# EAGLE design switching-led-driver-v2.0 (EAGLE 7.5.0)
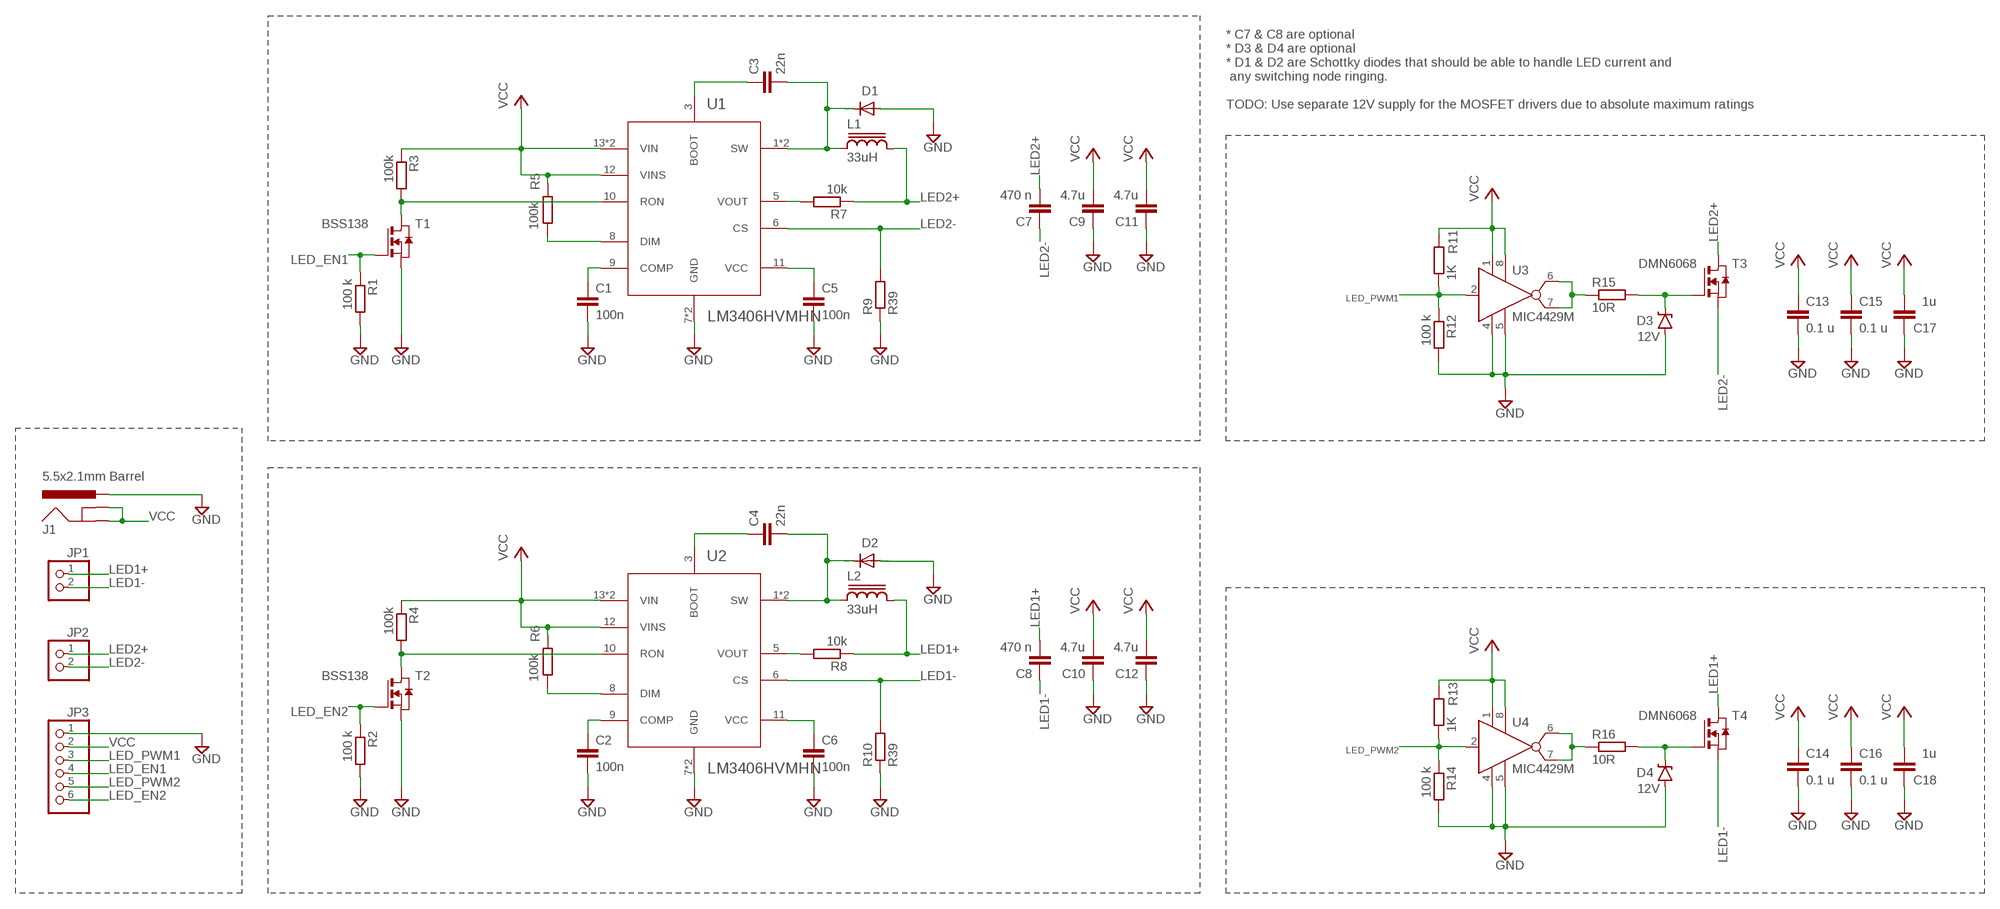
[diagram p0: schematic, sheet 1]

## Parts
C1  100n  C-EUC0805  [C0805]
C2  100n  C-EUC0805  [C0805]
C3  22n  C-EUC1206  [C1206]
C4  22n  C-EUC1206  [C1206]
C5  100n  C-EUC0805  [C0805]
C6  100n  C-EUC0805  [C0805]
C7  470 n  C-EUC1206  [C1206]
C8  470 n  C-EUC1206  [C1206]
C9  4.7u  C-EUC1210  [C1210]
C10  4.7u  C-EUC1210  [C1210]
C11  4.7u  C-EUC1210  [C1210]
C12  4.7u  C-EUC1210  [C1210]
C13  0.1 u  C-EUC0805  [C0805]
C14  0.1 u  C-EUC0805  [C0805]
C15  0.1 u  C-EUC0805  [C0805]
C16  0.1 u  C-EUC0805  [C0805]
C17  1u  C-EUC1210  [C1210]
C18  1u  C-EUC1210  [C1210]
D1  12V  DIODE-DO-214AC  [DO-214AC]
D2  12V  DIODE-DO-214AC  [DO-214AC]
D3  12V  DIODE-ZENER16V  [SOD-123]
D4  12V  DIODE-ZENER16V  [SOD-123]
J1  5.5x2.1mm Barrel  POWER_JACKSMD  [POWER_JACK_SMD]
JP1  PINHD-1X2  [1X02]
JP2  PINHD-1X2  [1X02]
JP3  PINHD-1X6  [1X06]
L1  33uH  SRR1260  [SRR1260]
L2  33uH  SRR1260  [SRR1260]
R1  100 k  R-EU_R0805  [R0805]
R2  100 k  R-EU_R0805  [R0805]
R3  100k  R-EU_R0805  [R0805]
R4  100k  R-EU_R0805  [R0805]
R5  100k  R-EU_R0805  [R0805]
R6  100k  R-EU_R0805  [R0805]
R7  10k  R-EU_R0805  [R0805]
R8  10k  R-EU_R0805  [R0805]
R9  R39  R-EU_R1206  [R1206]
R10  R39  R-EU_R1206  [R1206]
R11  1K  R-EU_R0805  [R0805]
R12  100 k  R-EU_R0805  [R0805]
R13  1K  R-EU_R0805  [R0805]
R14  100 k  R-EU_R0805  [R0805]
R15  10R  R-EU_R0805  [R0805]
R16  10R  R-EU_R0805  [R0805]
T1  BSS138  NMOSSOT23  [SOT-23]
T2  BSS138  NMOSSOT23  [SOT-23]
T3  DMN6068  NMOSSOT223  [SOT223]
T4  DMN6068  NMOSSOT223  [SOT223]
U1  LM3406HVMHN  [HTSSOP-14-NN]
U2  LM3406HVMHN  [HTSSOP-14-NN]
U3  MIC4429M  [SO08]
U4  MIC4429M  [SO08]

## Nets
GND: C1.2 C2.2 C5.2 C6.2 C9.1 C10.1 C11.1 C12.1 C13.2 C14.2 C15.2 C16.2 C17.1 C18.1 D1.A D2.A D3.A D4.A J1.VIN0(PWR) JP3.1 R1.2 R2.2 R9.1 R10.1 R12.2 R14.2 T1.2(S) T2.2(S) U1.7(GND) U1.15(GND) U2.7(GND) U2.15(GND) U3.4(GND1) U3.5(GND2) U4.4(GND1) U4.5(GND2)
LED1+: C8.2 JP1.1 L2.2 R8.1 T4.2(D) T4.4(D)
LED1-: C8.1 JP1.2 R10.2 T4.3(S) U2.6(CS)
LED2+: C7.2 JP2.1 L1.2 R7.1 T3.2(D) T3.4(D)
LED2-: C7.1 JP2.2 R9.2 T3.3(S) U1.6(CS)
LED_EN1: JP3.4 R1.1 T1.3(G)
LED_EN2: JP3.6 R2.1 T2.3(G)
LED_PWM1: JP3.3 R11.1 R12.1 U3.2(IN)
LED_PWM2: JP3.5 R13.1 R14.1 U4.2(IN)
N$1: R4.2 T2.1(D) U2.10(RON)
N$2: C2.1 U2.9(COMP)
N$3: C6.1 U2.11(VCC)
N$4: R16.1 U4.6(OUT1) U4.7(OUT2)
N$5: R8.2 U2.5(VOUT)
N$6: D3.C R15.2 T3.1(G)
N$7: D4.C R16.2 T4.1(G)
N$8: R3.2 T1.1(D) U1.10(RON)
N$9: C1.1 U1.9(COMP)
N$10: C5.1 U1.11(VCC)
N$11: C3.1 U1.3(BOOT)
N$12: C4.1 U2.3(BOOT)
N$13: R7.2 U1.5(VOUT)
N$14: R15.1 U3.6(OUT1) U3.7(OUT2)
PWM_IN_INT: R6.1 U2.8(DIM)
PWM_IN_INT1: R5.1 U1.8(DIM)
SW: C4.2 D2.C L2.1 U2.1(SW) U2.2(SW)
SW1: C3.2 D1.C L1.1 U1.1(SW) U1.2(SW)
VCC: C9.2 C10.2 C11.2 C12.2 C13.1 C14.1 C15.1 C16.1 C17.2 C18.2 J1.GND(GNDBREAK) J1.P$4(GND) JP3.2 R3.1 R4.1 R5.2 R6.2 R11.2 R13.2 U1.12(VINS) U1.13(VIN) U1.14(VIN) U2.12(VINS) U2.13(VIN) U2.14(VIN) U3.1(VS1) U3.8(VS2) U4.1(VS1) U4.8(VS2)

## Notes on the sheet
- * C7 & C8 are optional
  * D3 & D4 are optional
  * D1 & D2 are Schottky diodes that should be able to handle LED current and 
   any switching node ringing.
  
  TODO: Use separate 12V supply for the MOSFET drivers due to absolute maximum ratings

## Library data of the parts
C1-C12 C17 C18 = rcl:C-EU: CAPACITOR, European symbol; OC_FARNELL: 1759518
C13-C16 = rcl:C-EU: CAPACITOR, European symbol; OC_FARNELL: 1856626
D1 D2 = diode:DIODE-: DIODE; OC_FARNELL: 1702810
D3 D4 = sparkfun-misc-parts-1:DIODE-ZENER: Zener Diode Production Part - 8199 3.4V Zener Voltage; OC_FARNELL: 2061479; PROD_ID: DIO-12440; VALUE: 16V
J1 = SparkFun-Connectors:POWER_JACK: Power Jack This is the standard 5.5mm barrel jack for power. The PTH is the most common, proven, reliable, footprint. The Slot footprint only works if the mill layer is transmitted to the PCB fab house so be warned. Mating wall wart : TOL-00298 (and others); PROD_ID: CONN-08106; SF_ID: PRT-12748
JP1 JP2 = pinhead:PINHD-1X2: PIN HEADER
JP3 = pinhead:PINHD-1X6: PIN HEADER
L1 L2 = inductor-bourns:SRR1260: POWER INDUCTOR; OC_FARNELL: 2374128
R1-R4 R7-R10 R15 R16 = rcl:R-EU_: RESISTOR, European symbol; OC_FARNELL: 9336982
R5 R6 R11 R13 = rcl:R-EU_: RESISTOR, European symbol; OC_FARNELL: 2447473
R12 R14 = rcl:R-EU_: RESISTOR, European symbol; OC_FARNELL: 9337024
T1 T2 = zetex:NMOSSOT23: MOS FET; OC_FARNELL: 2053833; OC_NEWARK: unknown
T3 T4 = zetex:NMOSSOT223: MOS FET; OC_FARNELL: 2061415; OC_NEWARK: unknown
U1 U2 = misc-parts:LM3406HVMH: Constant Current Buck Regulator
U3 U4 = misc-parts:MIC4429: 6A-Peak Low-Side MOSFET Driver (INVERTED) Bipolar/CMOS/DMOS Process http://www.micrel.com/_PDF/mic4420.pdf

## Board
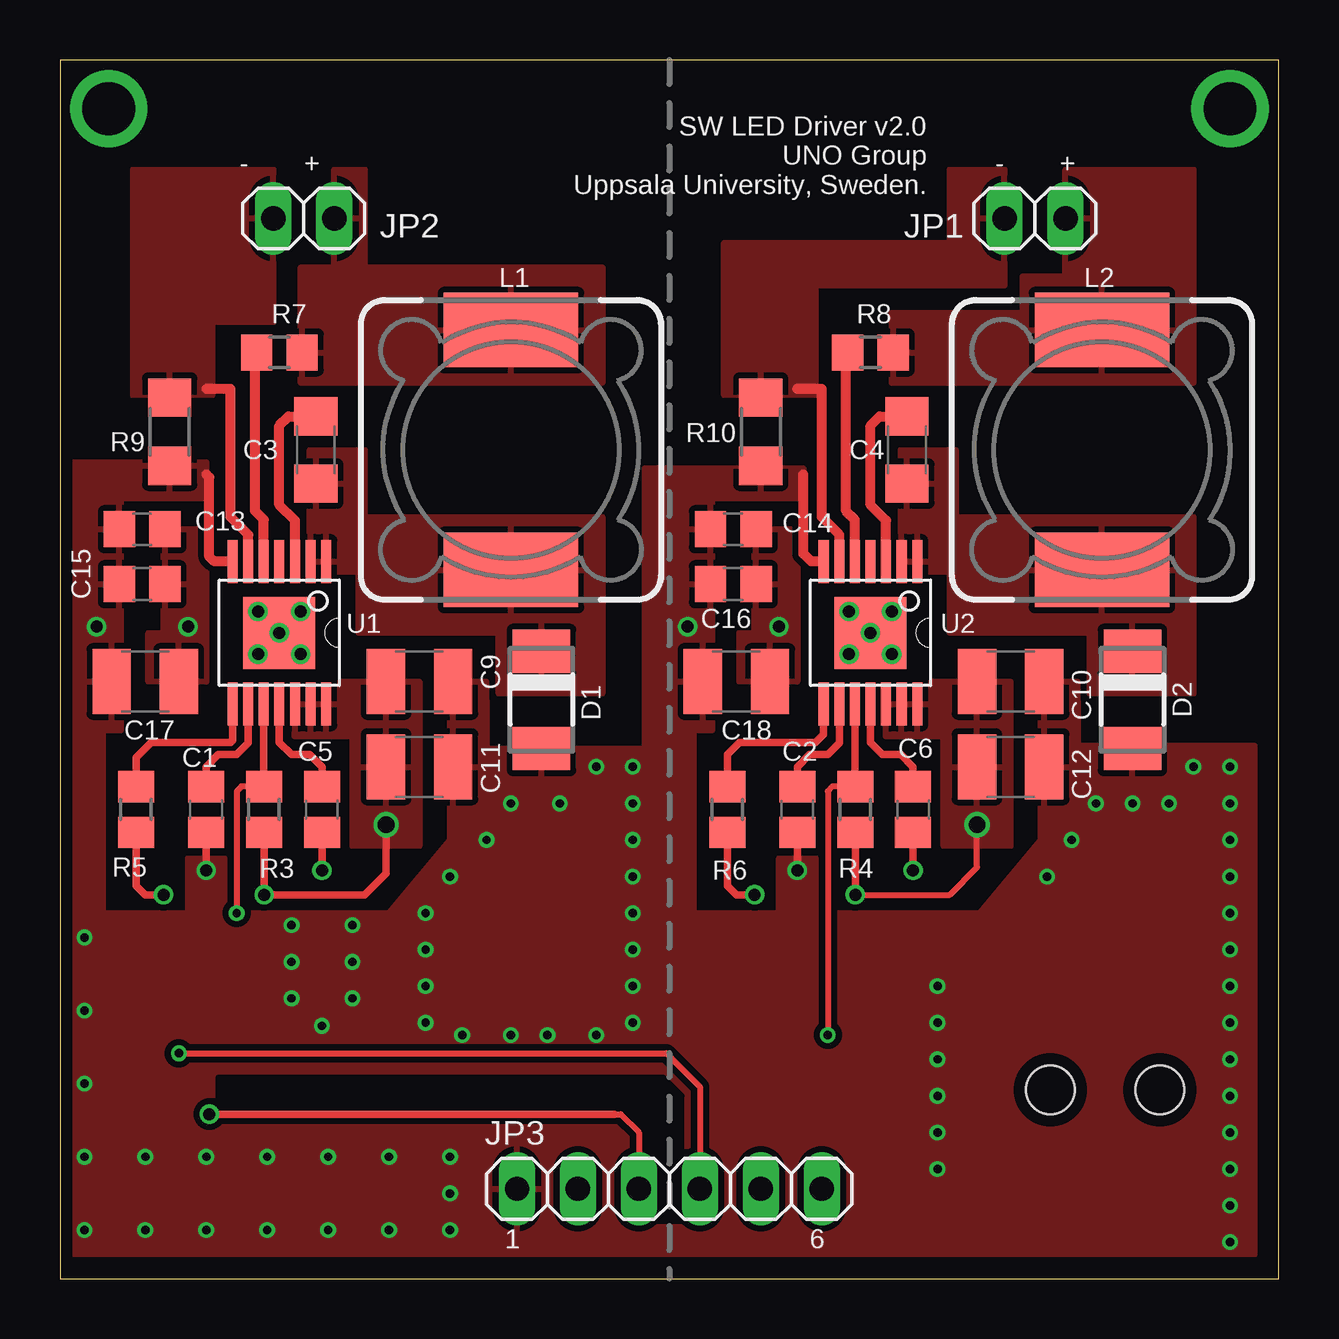
[diagram p1: board, top side]
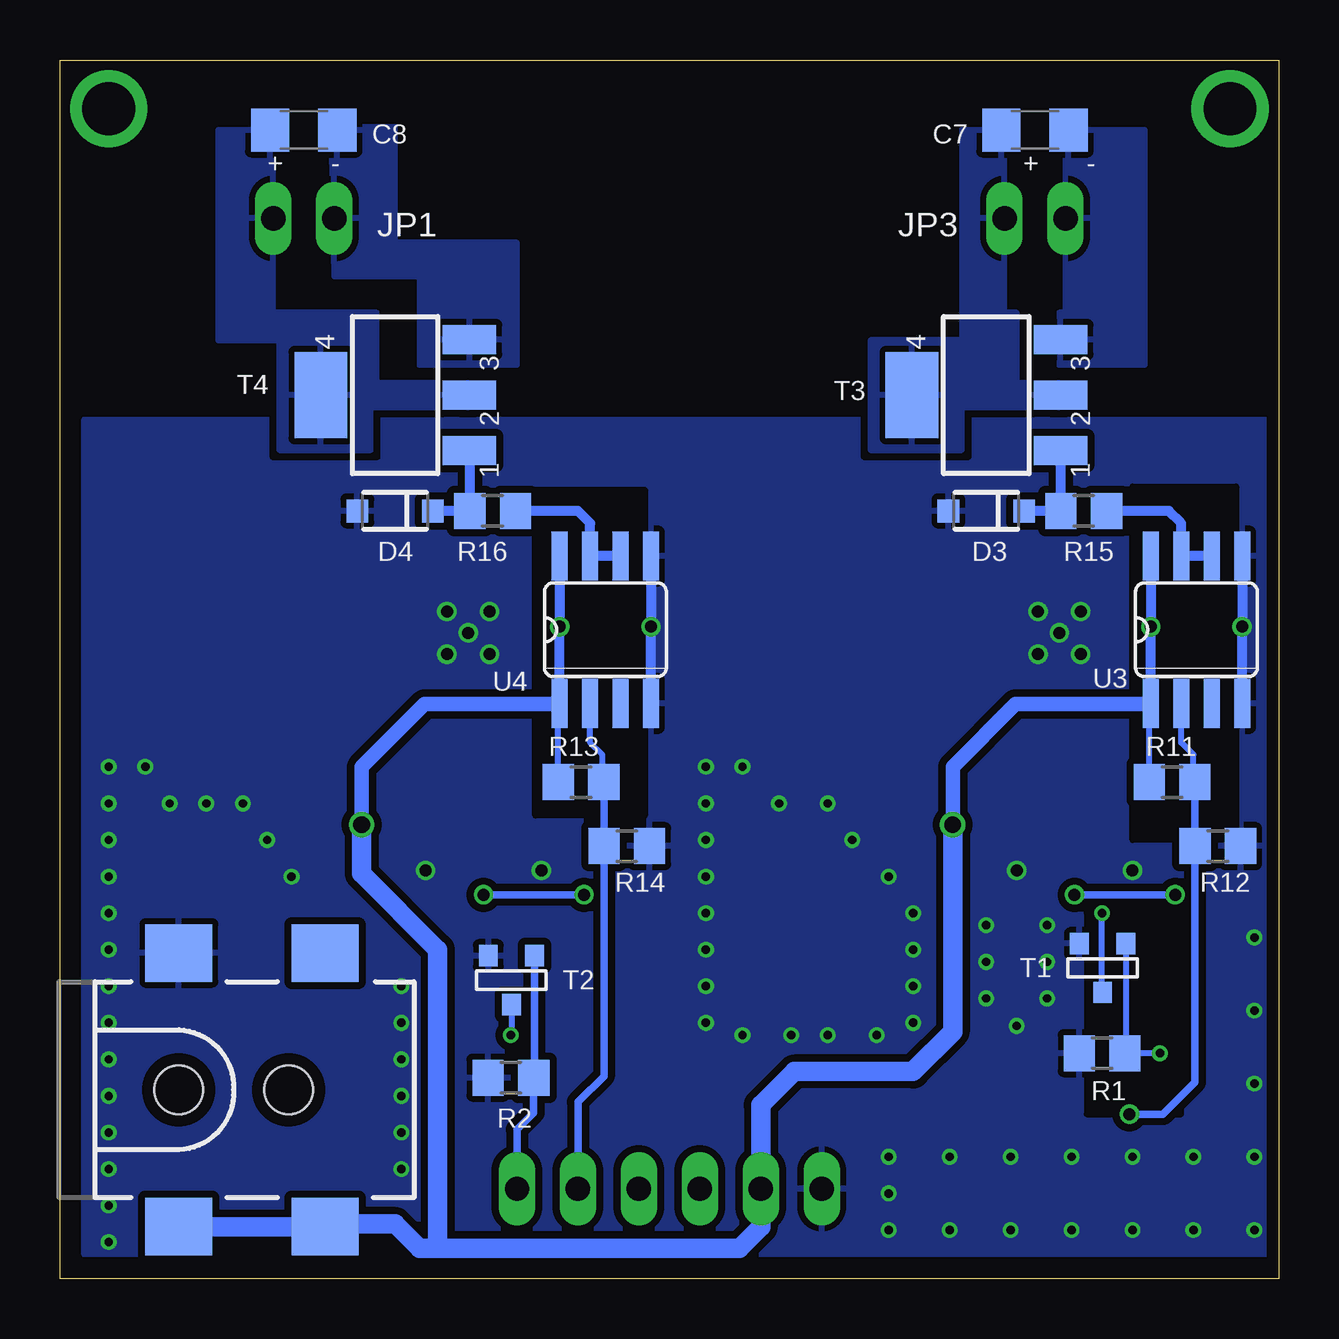
[diagram p2: board, bottom side, seen from below]

Size 50.8 x 50.8 mm. Coordinates in mm from the lower left corner, seen from the top.
Outline: 0,0 50.8,0 50.8,50.8 0,50.8 0,0
Copper layers (1*16): Top 0.035mm / dielectric 1.6mm / Bottom 0.035mm
Design rules "Elecrow-2-layer_PCB_eagle_rule": minimum track width 6mil, minimum drill 12mil, track to track 6mil, track to pad 8mil, pad to pad 12mil, via to via 12mil, smd to smd 0mil, copper to edge 20mil, drill to drill 10mil, minimum pad ring 6mil, minimum via ring 6mil, stop-mask expansion 0mil, vias tented up to drill 100mil, thermal gap 10mil

### Footprints (pad centres in the part's own frame; a part is rotated, then mirrored left to right if it is on the bottom)
C0805 = smd 1.3 x 1.5: 1 -0.95,0; 2 0.95,0
C1206 = smd 1.6 x 1.8: 1 -1.4,0; 2 1.4,0
C1210 = smd 1.6 x 2.7: 1 -1.4,0; 2 1.4,0
DO-214AC = smd 1.8 x 2.4: A 2.025,0; C -2.025,0
SOD-123 = smd 0.9 x 0.95: A 1.575,0; C -1.575,0
POWER_JACK_SMD = smd 2.8 x 2.4: GND 0,-5.7; P$4 6.1,-5.7; VIN0 0,5.7; VIN1 6.1,5.7 | hole 2.032: 0,0; 4.572,0
1X02 = drill 1.016 long: 1 -1.27,0; 2 1.27,0
1X06 = drill 1.016 long: 1 -6.35,0; 2 -3.81,0; 3 -1.27,0; 4 1.27,0; 5 3.81,0; 6 6.35,0
SRR1260 = smd 5.6 x 3.1: 1 0,5; 2 0,-5
R0805 = smd 1.3 x 1.5: 1 -0.95,0; 2 0.95,0
R1206 = smd 1.6 x 1.803: 1 -1.422,0; 2 1.422,0
SOT-23 = smd 0.787 x 0.889: 1 0.025,-1.016; 2 -0.94,1.016; 3 0.991,1.016
SOT223 = smd 1.219 x 2.235: 1 -2.311,-3.099; 2 0,-3.099; 3 2.311,-3.099 | smd 3.6 x 2.2: 4 0,3.099
HTSSOP-14-NN = smd 0.42 x 1.78: 1 -1.95,-2.97; 2 -1.3,-2.97; 3 -0.65,-2.97; 4 0,-2.97; 5 0.65,-2.97; 6 1.3,-2.97; 7 1.95,-2.97; 8 1.95,2.97; 9 1.3,2.97; 10 0.65,2.97; 11 0,2.97; 12 -0.65,2.97; 13 -1.3,2.97; 14 -1.95,2.97 | smd 3 x 3: 15 0,0
SO08 = smd 0.66 x 2.032: 1 -1.905,-3.073; 2 -0.635,-3.073; 3 0.635,-3.073; 4 1.905,-3.073; 5 1.905,3.073; 6 0.635,3.073; 7 -0.635,3.073; 8 -1.905,3.073

### Placement (x,y rotation side)
C1  6.1,19.56 270 top
C2  30.73,19.56 270 top
C3  10.67,34.54 270 top
C4  35.31,34.54 270 top
C5  10.92,19.56 270 top
C6  35.56,19.56 270 top
C7  10.16,47.88 180 bottom
C8  40.64,47.88 180 bottom
C9  14.99,24.89 180 top
C10  39.62,24.89 180 top
C11  14.99,21.34 180 top
C12  39.62,21.34 180 top
C13  3.43,31.24 180 top
C14  28.07,31.24 180 top
C15  3.43,28.96 180 top
C16  28.07,28.96 180 top
C17  3.56,24.89 0 top
C18  28.19,24.89 0 top
D1  20.07,24.13 270 top
D2  44.7,24.13 270 top
D3  12.19,32 180 bottom
D4  36.83,32 180 bottom
J1  45.85,7.87 0 bottom
JP1  40.64,44.2 180 top
JP2  10.16,44.2 180 top
JP3  25.4,3.75 0 top
L1  18.8,34.54 180 top
L2  43.43,34.54 180 top
R1  7.37,9.4 180 bottom
R2  32,8.38 180 bottom
R3  8.51,19.56 90 top
R4  33.15,19.56 90 top
R5  3.17,19.56 270 top
R6  27.81,19.56 270 top
R7  9.14,38.61 180 top
R8  33.78,38.61 180 top
R9  4.57,35.31 90 top
R10  29.21,35.31 90 top
R11  4.45,20.7 180 bottom
R12  2.54,18.03 0 bottom
R13  29.08,20.7 180 bottom
R14  27.18,18.03 0 bottom
R15  8.13,32 180 bottom
R16  32.77,32 180 bottom
T1  7.37,12.95 0 bottom
T2  32,12.45 0 bottom
T3  12.19,36.83 90 bottom
T4  36.83,36.83 90 bottom
U1  9.14,26.92 180 top
U2  33.78,26.92 180 top
U3  3.43,27.05 0 bottom
U4  28.07,27.05 0 bottom

### Tracks (layer width: path | path; a pad name or v marks a point on that pad's centre or on a via)
GND  (via drill 0.35, 0.5)
  Top 0.305: C2.2 v30.73,17.02 | C6.2 v35.56,17.02 | C1.2 v6.1,17.02 | C5.2 v10.92,17.02
  Top 0.406: U1.7 6.43,29.89 6.22,30.1 6.22,33.4 6.1,33.53 | U2.7 31.32,29.89 30.99,30.23 30.99,33.53
  Bottom 0.406: U4.5 v26.16,27.18 U4.4 | U3.5 v1.52,27.18 U3.4
  other vias: 33.78,26.92 32.89,27.81 32.89,26.04 34.67,27.81 34.67,26.04 9.14,26.92 8.26,27.81 8.26,26.04 10.03,27.81 10.03,26.04 47.24,21.34 48.77,21.34 46.23,19.81 44.7,19.81 43.18,19.81 42.16,18.29 41.15,16.76 48.77,19.81 48.77,18.29 48.77,16.76 48.77,15.24 48.77,13.72 48.77,12.19 48.77,10.67 48.77,9.14 36.58,12.19 36.58,10.67 36.58,9.14 48.77,7.62 48.77,6.1 48.77,4.57 48.77,3.05 48.77,1.52 36.58,7.62 36.58,6.1 36.58,4.57 23.88,19.81 23.88,21.34 22.35,21.34 20.83,19.81 18.8,19.81 23.88,18.29 23.88,16.76 23.88,15.24 23.88,13.72 23.88,12.19 23.88,10.67 17.78,18.29 16.26,16.76 15.24,15.24 15.24,13.72 15.24,12.19 15.24,10.67 16.76,10.16 20.32,10.16 22.35,10.16 18.8,10.16 16.26,5.08 16.26,2.03 16.26,3.56 13.72,5.08 13.72,2.03 11.18,2.03 8.64,2.03 6.1,2.03 3.56,2.03 1.02,2.03 11.18,5.08 8.64,5.08 6.1,5.08 3.56,5.08 1.02,5.08 1.02,8.13 1.02,11.18 1.02,14.22 12.19,14.73 9.65,14.73 9.65,13.21 9.65,11.68 12.19,13.21 12.19,11.68 10.92,10.54
  pour Top (isolate 0.254, rank 2): 40.89,24.89 42.42,24.89 42.42,22.23 49.78,22.23 49.78,1.02 0.51,1.02 0.51,34.04 6.1,34.04 6.1,32.51 2.54,32.51 2.54,22.86 1.78,22.86 1.78,15.24 5.33,15.24 5.33,17.53 6.86,17.53 6.86,15.24 13.72,15.24 16.26,18.29 16.26,24.89 17.78,24.89 17.78,22.1 24.38,22.1 24.38,33.78 30.99,33.78 30.99,32.51 27.18,32.51 27.18,22.86 26.42,22.86 26.42,15.24 29.97,15.24 29.97,17.53 31.5,17.53 31.5,15.24 38.35,15.24 40.89,18.29
  pour Bottom (isolate 0.305, rank 2): 0.51,1.02 49.78,1.02 49.78,35.81 0.51,35.81
LED1+
  pour Top (isolate 0.254): 41.91,46.23 47.24,46.23 47.24,37.34 34.67,37.34 34.67,40.26 40.13,40.26 40.13,41.78 41.91,41.78
  pour Bottom (isolate 0.254): 41.91,47.88 44.2,47.88 44.2,39.12 41.66,39.12 41.66,34.54 37.85,34.54 37.85,36.32 33.78,36.32 33.78,37.34 37.59,37.34 37.59,40.26 41.91,40.26
LED1-
  Top 0.406: U2.6 32.48,31.02 31.75,31.75 31.75,37.08 30.73,37.08
  pour Top (isolate 0.254, rank 2): 27.69,43.18 37.08,43.18 37.08,46.23 39.37,46.23 39.37,41.4 31.5,41.4 31.5,36.83 27.69,36.83
  pour Bottom (isolate 0.254): 36.83,48.01 39.5,48.01 39.37,41.78 35.81,41.78 35.81,38.1 31.75,38.1 31.75,43.18 36.83,43.18
LED2+
  pour Bottom (isolate 0.254): 11.43,47.88 13.21,47.88 13.21,39.12 17.02,39.12 17.02,34.54 13.21,34.54 13.21,36.32 9.14,36.32 9.14,37.34 10.92,37.34 10.92,40.26 11.43,40.26
  pour Top (isolate 0.254): 11.43,46.23 12.7,46.23 12.7,42.16 22.61,42.16 22.61,37.34 10.03,37.34 10.03,42.16 11.43,42.16
LED2-
  Top 0.406: U1.6 7.84,31.02 7.11,31.75 7.11,37.08 6.1,37.08
  pour Bottom (isolate 0.254): 5.59,47.88 8.89,47.88 8.89,40.26 9.14,40.26 9.14,38.1 5.59,38.1
  pour Top (isolate 0.254): 3.05,46.23 8.89,46.23 8.89,39.88 6.35,39.88 6.35,36.83 3.05,36.83
LED_EN1  (via drill 0.35)
  Top 0.254: v4.95,9.4 25.27,9.4 26.67,8 JP3.4
  Bottom 0.254: T1.3 6.38,9.44 R1.1 v4.95,9.4
LED_EN2
  Bottom 0.254: R2.1 31.01,8.89
  Bottom 0.305: 31.01,8.89 T2.3 | R2.1 31.05,6.92 31.75,6.22 JP3.6
LED_PWM1  (via drill 0.5)
  Top 0.254: 23.11,6.86 23.37,6.86 24.13,6.1 JP3.3
  Top 0.305: v6.22,6.86 23.11,6.86
  Bottom 0.254: 3.56,20.76 3.56,21.84 4.06,22.35 U3.2
  Bottom 0.305: v6.22,6.86 4.83,6.86 3.49,8.19 R12.1 R11.1
  Bottom 0.406: 3.56,20.76 R11.1
LED_PWM2
  Bottom 0.254: 28.19,20.76 28.19,21.84 28.7,22.35 U4.2
  Bottom 0.305: R13.1 R14.1 28.13,8.44 29.21,7.37 JP3.5
  Bottom 0.406: 28.19,20.76 R13.1 | R14.1
N$1  (via drill 0.35)
  Top 0.254: 32.62,20.52 32.21,20.52 32,20.32 v32,10.16
  Top 0.305: U2.10 33.13,20.52 R4.2
  Top 0.406: 32.62,20.52 R4.2
  Bottom 0.254: 32,11.46 T2.1 31.98,10.19 v32,10.16
N$2
  Top 0.305: U2.9 32.48,22.32 32,21.84 31.24,21.84 30.73,21.34 C2.1
N$3
  Top 0.305: U2.11 33.78,22.35 34.29,21.84 35.05,21.84 35.56,21.34 C6.1
N$4
  Bottom 0.406: U4.6 U4.7 28.7,31.5 29.21,32 R16.1
N$5
  Top 0.406: U2.5 33.13,31.64 32.77,32 32.77,38.54 R8.2
N$6
  Bottom 0.406: T3.1 9.08,34.5 R15.2 D3.C
N$7
  Bottom 0.406: T4.1 33.72,34.5 R16.2 D4.C
N$8  (via drill 0.35)
  Top 0.254: 7.99,20.52 7.57,20.52 7.37,20.32 v7.37,15.24
  Top 0.305: U1.10 8.49,20.52 R3.2
  Top 0.406: 7.99,20.52 R3.2
  Bottom 0.254: T1.1 7.37,11.96 v7.37,15.24
N$9
  Top 0.305: U1.9 7.84,22.32 7.37,21.84 6.6,21.84 6.1,21.34 C1.1
N$10
  Top 0.305: U1.11 9.14,22.35 9.65,21.84 10.41,21.84 10.92,21.34 C5.1
N$11
  Top 0.406: U1.3 9.79,31.61 9.14,32.26 9.14,35.56 9.53,35.94 C3.1
N$12
  Top 0.406: U2.3 34.43,31.61 33.78,32.26 33.78,35.56 34.16,35.94 C4.1
N$13
  Top 0.406: U1.5 8.49,31.64 8.13,32 8.13,38.54 R7.2
N$14
  Bottom 0.406: U3.6 U3.7 4.06,31.5 4.57,32 R15.1
N$15
  cutout Bottom (isolate 0.254): 4.06,15.24 8,15.24 8,6.86 4.06,6.86
N$17
  cutout Bottom (isolate 0.254, rank 2): 30.99,19.3 30.99,32.89 26.42,32.89 26.42,19.3
N$18
  cutout Bottom (isolate 0.254, rank 2): 1.78,33.02 1.78,18.29 6.1,18.29 6.1,33.02
N$19
  cutout Top (isolate 0.254, rank 2): 23.88,2.41 25.91,2.41 25.91,7.62 25.15,8.38 6.6,8.38 6.6,7.11 23.88,7.11
N$200  (via drill 2.2)
  other vias: 2.03,48.77
N$201  (via drill 2.2)
  other vias: 48.77,48.77
PWM_IN_INT
  Top 0.305: U2.8 31.83,22.69 31.5,22.35 28.32,22.35 27.81,21.84 R6.1
PWM_IN_INT1
  Top 0.305: U1.8 7.19,22.43 7.11,22.35 3.81,22.35 3.17,21.72 R5.1
SW
  pour Top (isolate 0.254): 35.05,34.54 37.34,34.54 37.34,31.75 47.24,31.75 47.24,24.38 42.93,24.38 42.93,26.92 37.08,26.92 37.08,29.46 35.05,29.46
SW1
  pour Top (isolate 0.254): 10.41,34.54 12.7,34.54 12.7,31.75 22.61,31.75 22.61,24.38 18.29,24.38 18.29,26.92 12.45,26.92 12.45,29.46 10.41,29.46
VCC  (via drill 0.5, 0.7)
  Top 0.254: v33.15,16 37.08,16 38.23,17.14 v38.23,18.92
  Top 0.305: R6.2 27.81,16.38 28.19,16 v28.96,16 | R4.1 v33.15,16 | R5.2 3.17,16.38 3.56,16 v4.32,16 | R3.1 v8.51,16 12.7,16 13.59,16.89 v13.59,18.92
  Bottom 0.254: R13.2 30.03,23.92 U4.1 | R11.2 5.39,23.92 U3.1
  Bottom 0.305: v28.96,16 v33.15,16 | v4.32,16 v8.51,16
  Bottom 0.406: U4.8 v29.97,27.18 U4.1 30,23.95 | v38.22,18.93 v38.23,18.92 | U3.8 v5.33,27.18 U3.1 5.36,23.95 | v13.59,18.93 v13.59,18.92
  Bottom 0.61: v38.22,18.93 C12.2 35.61,23.95 30,23.95 | v13.59,18.93 C11.2 10.97,23.95 5.36,23.95
  Bottom 0.813: 35.05,1.27 22.48,1.27 21.59,2.16 JP3.2 21.59,7.24 20.19,8.64 15.24,8.64 13.59,10.29 v13.59,18.93 | 35.05,1.27 35.81,1.27 36.83,2.29 39.25,2.29 J1.P$4 J1.GND | v38.23,18.92 38.23,16.89 35.05,13.72 35.05,1.27
  pour Top (isolate 0.254): 34.42,24.13 35.81,24.13 36.32,24.89 39.62,24.89 39.62,18.03 36.83,18.03 36.83,22.61 34.42,22.61
  pour Top (isolate 0.254): 28.96,31.24 30.73,31.24 30.73,24.89 28.32,24.89 28.32,26.92 28.96,26.92
  pour Top (isolate 0.254): 9.78,24.13 11.18,24.13 11.68,24.89 14.99,24.89 14.99,18.03 12.19,18.03 12.19,22.61 9.78,22.61
  pour Top (isolate 0.254): 4.32,31.24 6.1,31.24 6.1,24.89 3.68,24.89 3.68,26.92 4.32,26.92

### Text on the board
tNames: - | + | - | + | SW LED Driver v2.0 / UNO Group / Uppsala University, Sweden. | 1 | 6
bNames: - | + | - | + | JP3 | JP1